# EAGLE schematic Sensor Board AS-3 (EAGLE 9.6.2)
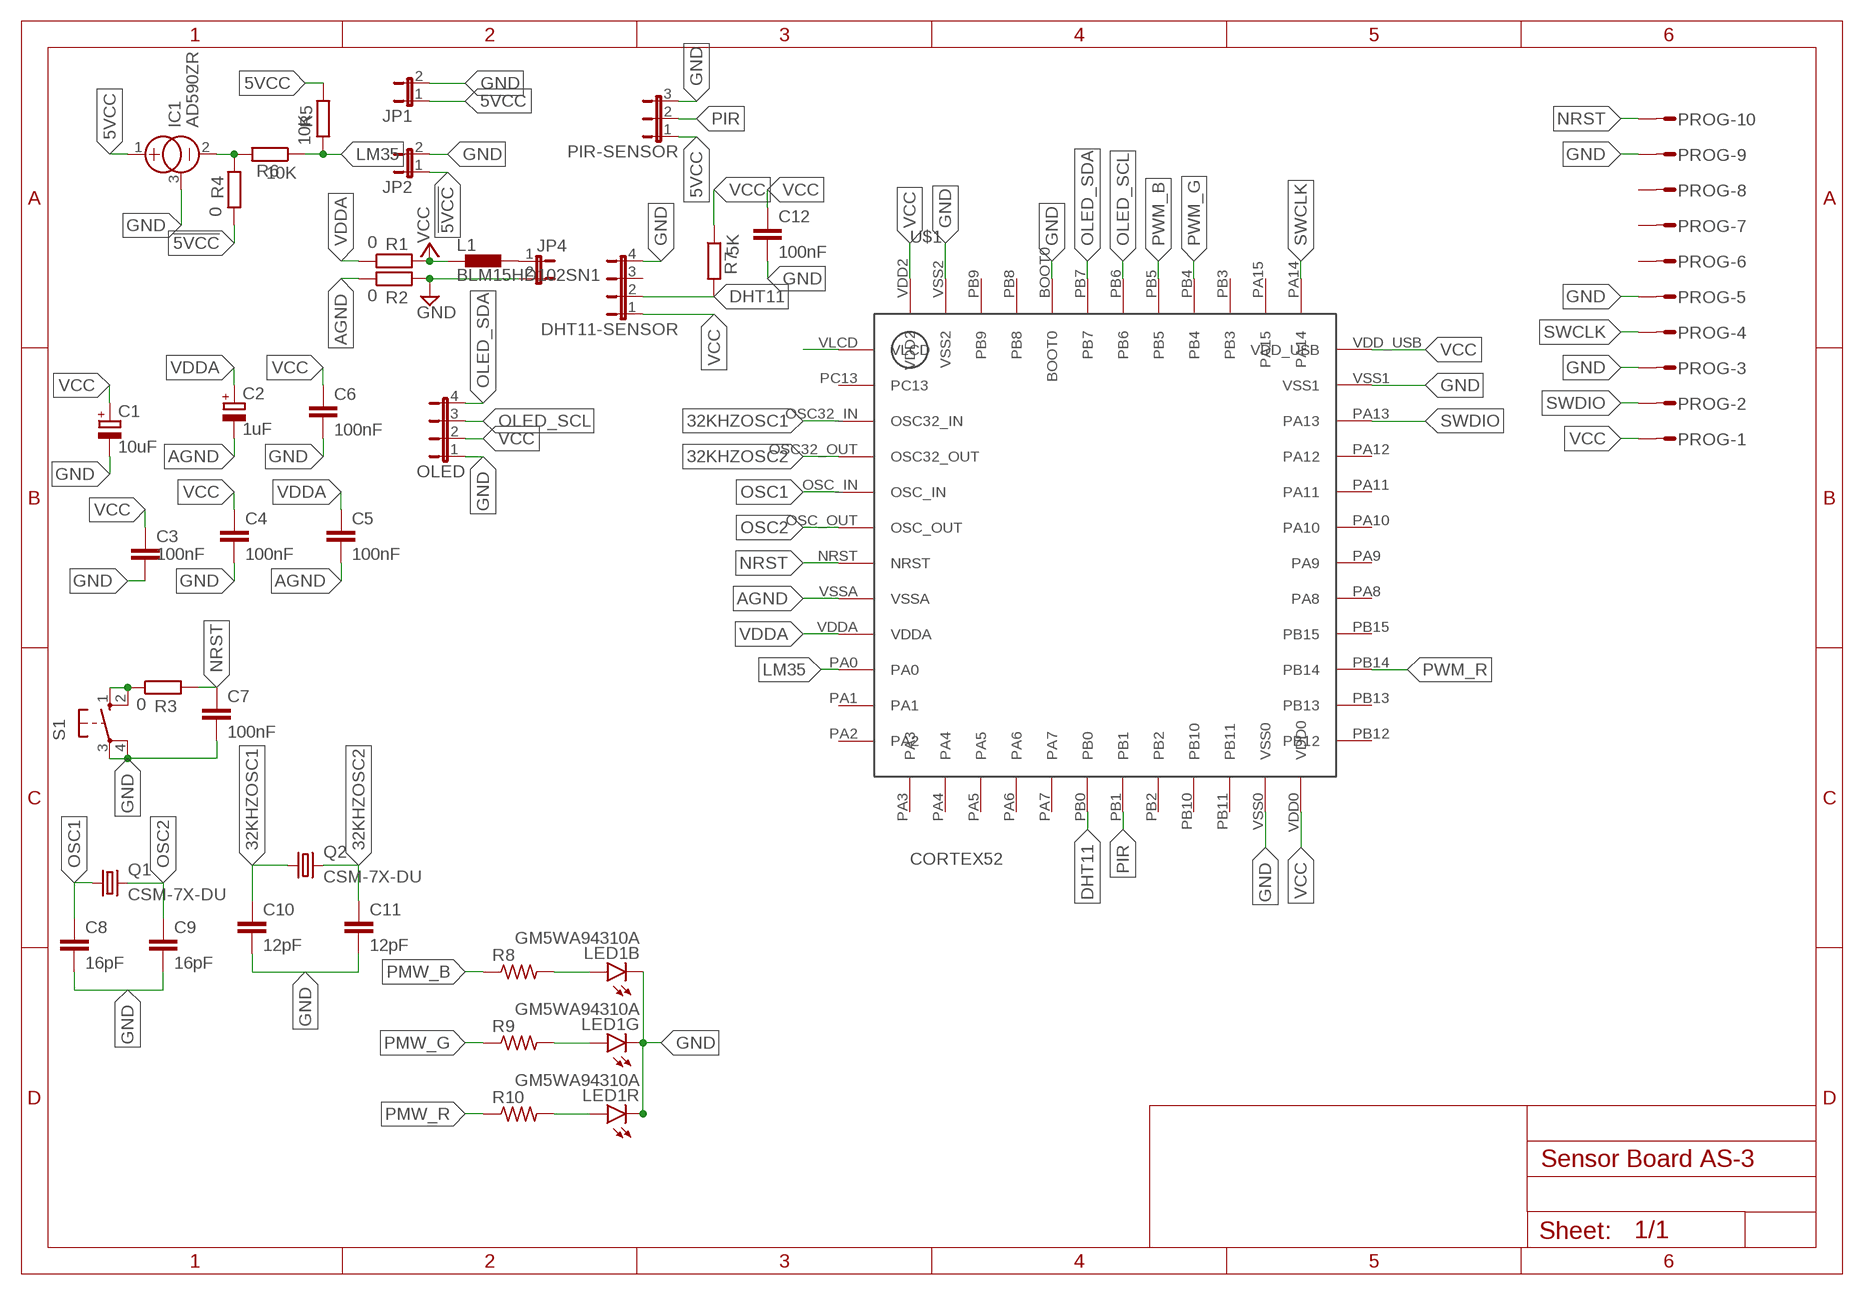
[diagram p0: schematic, sheet 1]

## Parts
C1  10uF  CPOL-EU139CLL-2R  [139CLL-2R]
C2  1uF  CPOL-EU139CLL-2R  [139CLL-2R]
C3  100nF  C-EUC0805  [C0805]
C4  100nF  C-EUC0805  [C0805]
C5  100nF  C-EUC0805  [C0805]
C6  100nF  C-EUC0805  [C0805]
C7  100nF  C-EUC0805  [C0805]
C8  16pF  C-EUC0805  [C0805]
C9  16pF  C-EUC0805  [C0805]
C10  12pF  C-EUC0805  [C0805]
C11  12pF  C-EUC0805  [C0805]
C12  100nF  C-EUC0805  [C0805]
DHT11-SENSOR  JP4E  [JP4]
IC1  AD590ZR  [TO92]
JP1  JP1E  [JP1]
JP2  JP1E  [JP1]
JP4  JP1E  [JP1]
L1  BLM15HD102SN1  [0402]
LED1  GM5WA94310A  [GM5WA94310A]
OLED  JP4E  [JP4]
PIR-SENSOR  JP2E  [JP2]
PROG  S10P  [S10P]
Q1  CSM-7X-DU  [CSM-7X-DU]
Q2  CSM-7X-DU  [CSM-7X-DU]
R1  0  R-EU_R0805  [R0805]
R2  0  R-EU_R0805  [R0805]
R3  0  R-EU_R0805  [R0805]
R4  0  R-EU_R0805  [R0805]
R5  10K  R-EU_R0805  [R0805]
R6  10K  R-EU_R0805  [R0805]
R7  5K  R-EU_R0805  [R0805]
R8  R-US_R0805  [R0805]
R9  R-US_R0805  [R0805]
R10  R-US_R0805  [R0805]
S1  10-XX  [B3F-10XX]
U$1  CORTEX52  [CORTEX52]

## Nets
5VCC: IC1.1(+) JP1.1 PIR-SENSOR.1 R5.2
32KHZOSC1: C10.1 Q2.1 U$1.OSC32_IN
32KHZOSC2: C11.1 Q2.2 U$1.OSC32_OUT
!5VCC: JP2.1 R4.1
AGND: C2.- C5.2 R2.1 U$1.VSSA
DHT11: DHT11-SENSOR.2 R7.2 U$1.PB0
GND: C1.- C3.2 C4.2 C6.2 C7.2 C8.2 C9.2 C10.2 C11.2 C12.2 DHT11-SENSOR.4 IC1.3(CAN) JP1.2 JP2.2 JP4.2 LED1.4(G:C) LED1.5(R:C) LED1.6(B:C) OLED.1 PIR-SENSOR.3 PROG.3 PROG.5 PROG.9 R2.2 S1.3(P) S1.4(P1) U$1.BOOT0 U$1.VSS0 U$1.VSS1 U$1.VSS2
LM35: R5.1 R6.1 U$1.PA0
N$1: JP4.1 L1.2
N$2: R3.1 S1.1(S) S1.2(S1)
N$3: IC1.2(-) R4.2 R6.2
N$4: LED1.1(B:A) R8.2
N$5: U$1.VLCD
N$6: LED1.3(G:A) R9.2
N$7: LED1.2(R:A) R10.2
NRST: C7.1 PROG.10 R3.2 U$1.NRST
OLED_SCL: OLED.3 U$1.PB6
OLED_SDA: OLED.4 U$1.PB7
OSC1: C8.1 Q1.1 U$1.OSC_IN
OSC2: C9.1 Q1.2 U$1.OSC_OUT
PIR: PIR-SENSOR.2 U$1.PB1
PMW_B: R8.1
PMW_G: R9.1
PMW_R: R10.1
PWM_B: U$1.PB5
PWM_G: U$1.PB4
PWM_R: U$1.PB14
SWCLK: PROG.4 U$1.PA14
SWDIO: PROG.2 U$1.PA13
VCC: C1.+ C3.1 C4.1 C6.1 C12.1 DHT11-SENSOR.1 L1.1 OLED.2 PROG.1 R1.2 R7.1 U$1.VDD0 U$1.VDD2 U$1.VDD_USB
VDDA: C2.+ C5.1 R1.1 U$1.VDDA
Unconnected: DHT11-SENSOR.3 PROG.6 PROG.7 PROG.8 U$1.PA1 U$1.PA2 U$1.PA3 U$1.PA4 U$1.PA5 U$1.PA6 U$1.PA7 U$1.PA8 U$1.PA9 U$1.PA10 U$1.PA11 U$1.PA12 U$1.PA15 U$1.PB2 U$1.PB3 U$1.PB8 U$1.PB9 U$1.PB10 U$1.PB11 U$1.PB12 U$1.PB13 U$1.PB15 U$1.PC13

## Library data of the parts
C1 C2 = rcl:CPOL-EU: POLARIZED CAPACITOR, European symbol; SPICEPREFIX: C
C3-C12 = rcl:C-EU: CAPACITOR, European symbol; SPICEPREFIX: C
DHT11-SENSOR OLED = jumper:JP4E: JUMPER
IC1 = linear:AD590ZR: TEMPERATURE SENSOR current output
JP1 JP2 JP4 = jumper:JP1E: JUMPER
L1 = inductors:BLM15H: EMIFIL (R) Chip Ferrite Bead for GHz Noise Source: http://www.murata.com/ Ferrite Bead BLM15H.pdf
LED1 = led:GM5WA94310A: Chip LED RGB Source: http://document.sharpsma.com/files/GM5WA94310A_SS.pdf
PIR-SENSOR = jumper:JP2E: JUMPER
PROG = con-amp-mt:S10P: AMP MT CONNECTOR; OC_FARNELL: unknown; OC_NEWARK: unknown
Q1 Q2 = crystal:CSM-7X-DU: SMD CRYSTAL Source: www.ecsxtal.com .. Crystal 3.6864MHz CSM_7X_DU.PDF; OC_FARNELL: unknown; OC_NEWARK: unknown
R1-R7 = rcl:R-EU_: RESISTOR, European symbol; SPICEPREFIX: R
R8-R10 = rcl:R-US_: RESISTOR, American symbol; SPICEPREFIX: R
S1 = switch-omron:10-XX: OMRON SWITCH; MPN: B3F-1000; OC_FARNELL: 176432; OC_NEWARK: 36M3542
U$1 = coxtex32:CORTEX52